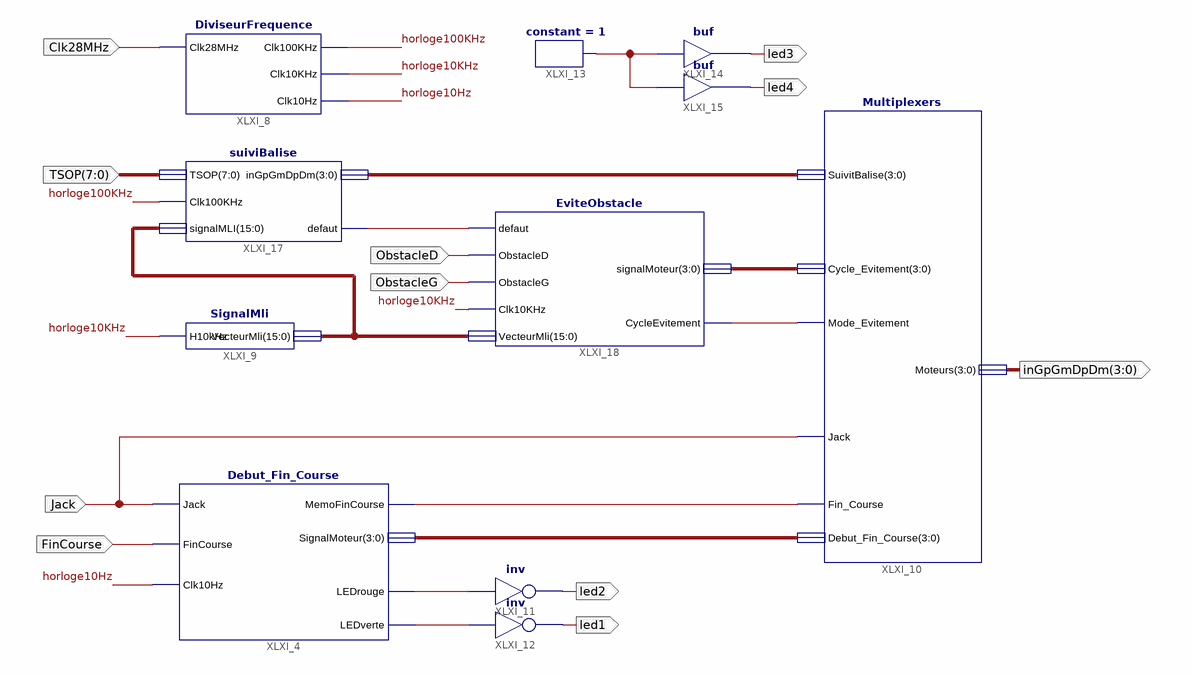
[diagram p0: schematic sheet 1]
// Xilinx ISE schematic schemasComplet.sch (spartan3a) as structural Verilog: 11 symbols, 11 ports
module schemasComplet (
  input  Clk28MHz,
  input  ObstacleD,
  input  ObstacleG,
  input  [7:0] TSOP,
  input  FinCourse,
  input  Jack,
  output led4,
  output led3,
  output [3:0] inGpGmDpDm,
  output led1,
  output led2
);

  wire horloge10Hz, horloge10KHz, horloge100KHz, XLXN_26, XLXN_27, XLXN_30, XLXN_178, XLXN_184, XLXN_240;
  wire [3:0] XLXN_177, XLXN_183, XLXN_239;
  wire [15:0] XLXN_210;

  DiviseurFrequence XLXI_8 (
    .Clk28MHz(Clk28MHz), .Clk10KHz(horloge10KHz), .Clk10Hz(horloge10Hz), .Clk100KHz(horloge100KHz));
  suiviBalise XLXI_17 (
    .signalMLI(XLXN_210), .TSOP(TSOP), .Clk100KHz(horloge100KHz), .inGpGmDpDm(XLXN_177), .defaut(XLXN_178));
  constant #(.CValue("1")) XLXI_13 (.O(XLXN_30));
  buf XLXI_15 (led4, XLXN_30);
  buf XLXI_14 (led3, XLXN_30);
  EviteObstacle XLXI_18 (
    .defaut(XLXN_178), .CycleEvitement(XLXN_184), .signalMoteur(XLXN_183), .ObstacleD(ObstacleD),
    .ObstacleG(ObstacleG), .VecteurMli(XLXN_210), .Clk10KHz(horloge10KHz));
  Multiplexers XLXI_10 (
    .Mode_Evitement(XLXN_184), .SuivitBalise(XLXN_177), .Cycle_Evitement(XLXN_183), .Moteurs(inGpGmDpDm),
    .Jack(Jack), .Fin_Course(XLXN_240), .Debut_Fin_Course(XLXN_239));
  SignalMli XLXI_9 (.H10kHz(horloge10KHz), .VecteurMli(XLXN_210));
  not XLXI_12 (led1, XLXN_27);
  not XLXI_11 (led2, XLXN_26);
  Debut_Fin_Course XLXI_4 (
    .Jack(Jack), .FinCourse(FinCourse), .Clk10Hz(horloge10Hz), .LEDrouge(XLXN_26), .LEDverte(XLXN_27),
    .MemoFinCourse(XLXN_240), .SignalMoteur(XLXN_239));
endmodule
